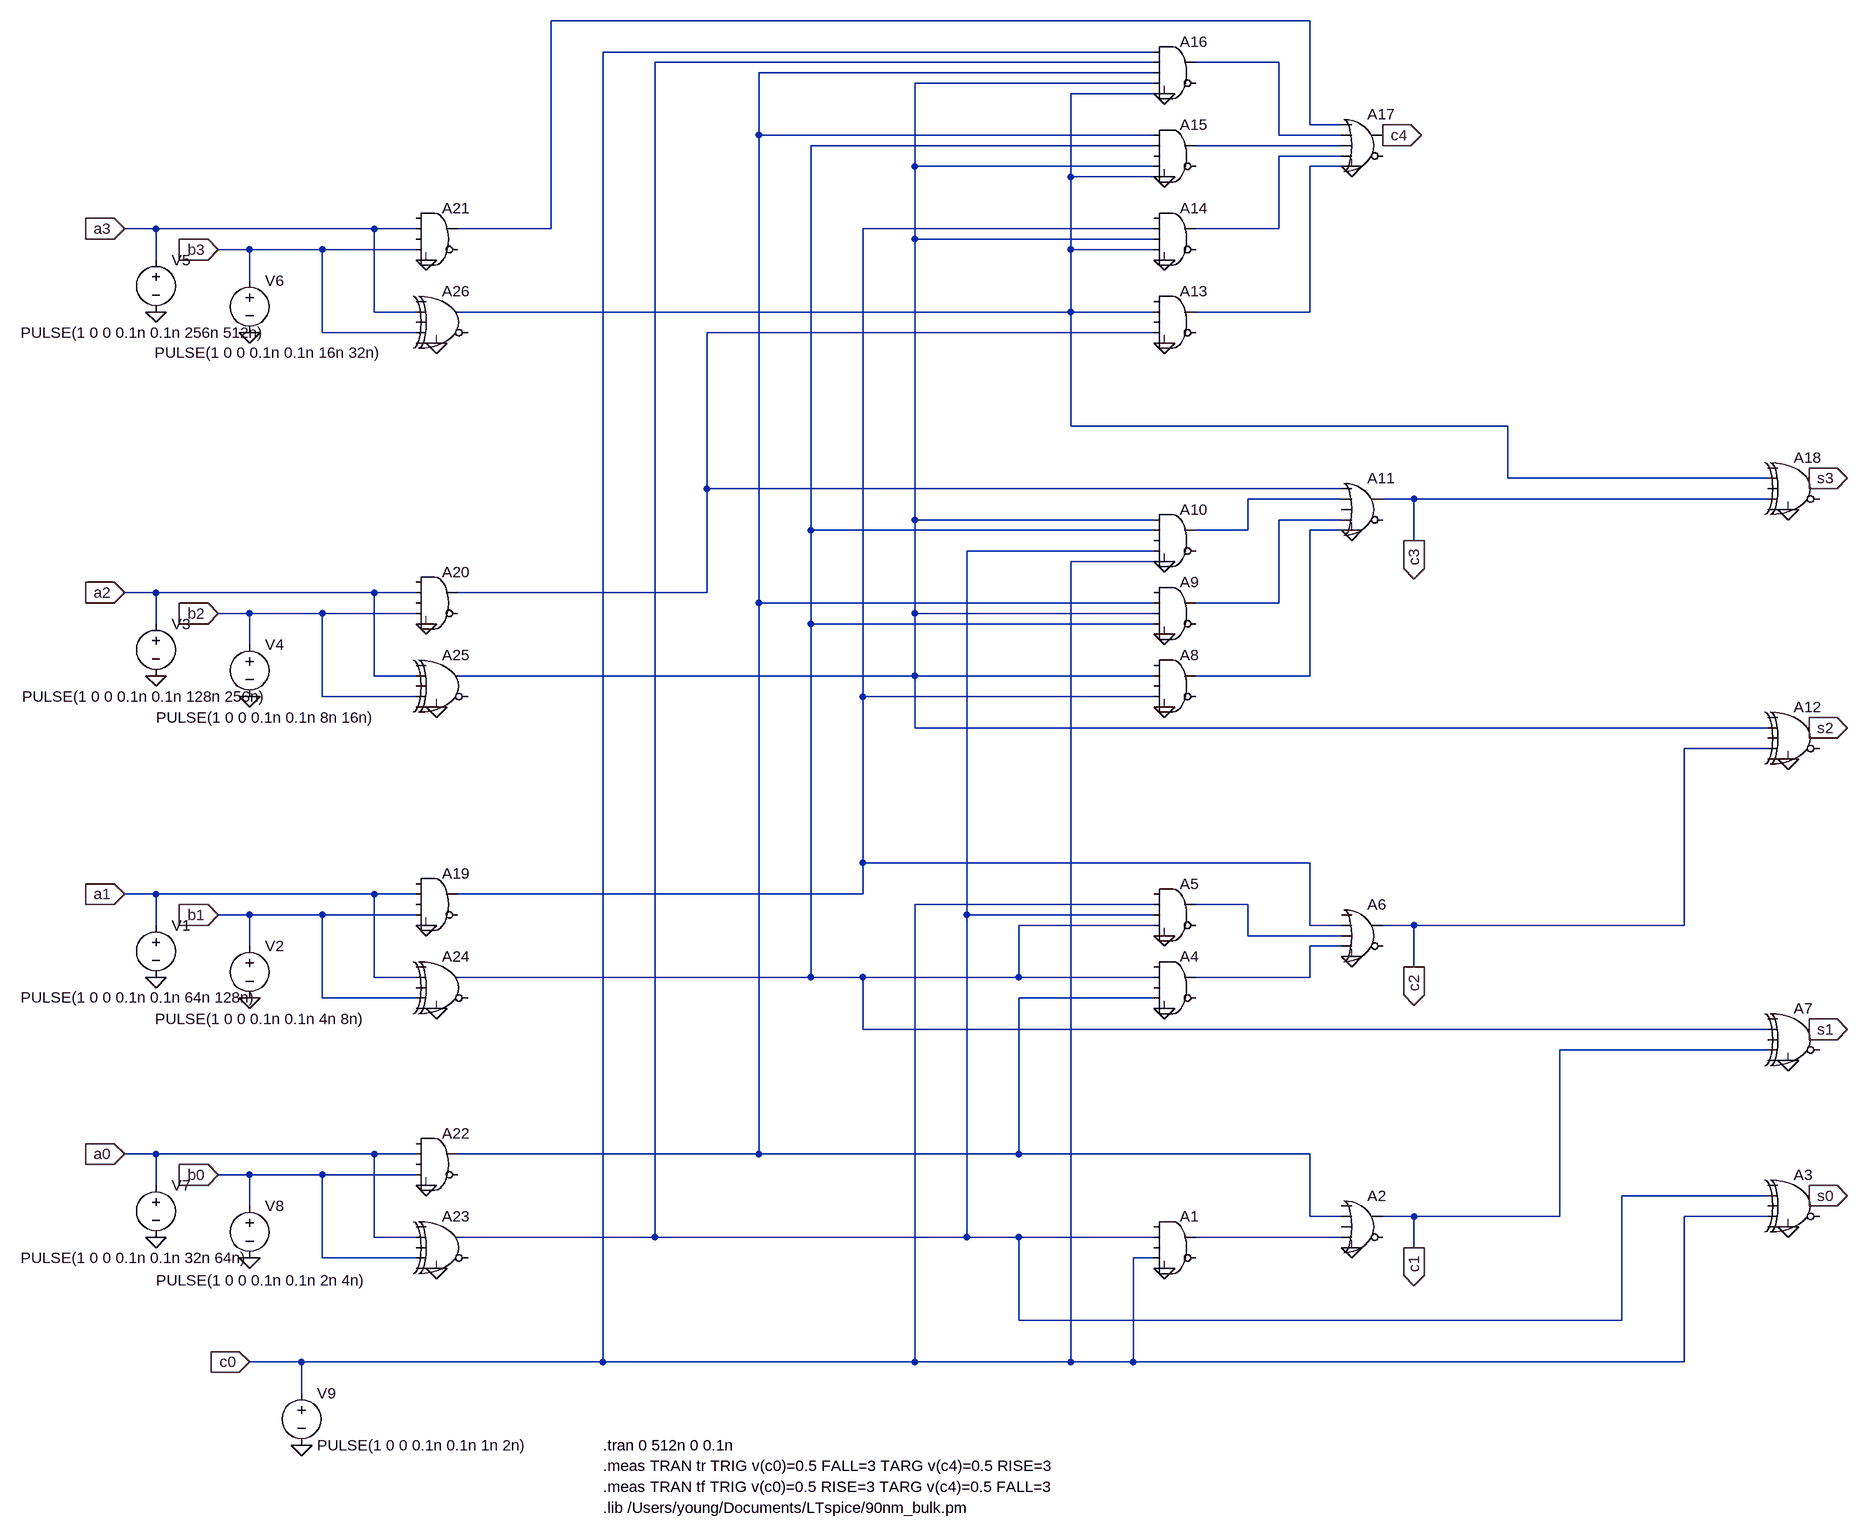
[diagram p0: schematic 4-bit-CLA.asc]
4-bit-CLA.asc, the LTspice schematic file:
Version 4
SHEET 1 2044 1460
WIRE 1216 -992 48 -992
WIRE 976 -944 128 -944
WIRE 976 -928 208 -928
WIRE 1168 -928 1040 -928
WIRE 976 -912 368 -912
WIRE 976 -896 608 -896
WIRE 976 -880 848 -880
WIRE 1216 -832 1216 -992
WIRE 1264 -832 1216 -832
WIRE 368 -816 368 -912
WIRE 976 -816 368 -816
WIRE 1168 -816 1168 -928
WIRE 1264 -816 1168 -816
WIRE 976 -800 448 -800
WIRE 1264 -800 1040 -800
WIRE 1264 -784 1168 -784
WIRE 608 -768 608 -896
WIRE 976 -768 608 -768
WIRE 1264 -768 1216 -768
WIRE 848 -752 848 -880
WIRE 976 -752 848 -752
WIRE -560 -672 -608 -672
WIRE -224 -672 -560 -672
WIRE -160 -672 -224 -672
WIRE 48 -672 48 -992
WIRE 48 -672 -96 -672
WIRE 976 -672 528 -672
WIRE 1168 -672 1168 -784
WIRE 1168 -672 1040 -672
WIRE 608 -656 608 -768
WIRE 976 -656 608 -656
WIRE -416 -640 -464 -640
WIRE -304 -640 -416 -640
WIRE -160 -640 -304 -640
WIRE 848 -640 848 -752
WIRE 976 -640 848 -640
WIRE -560 -624 -560 -672
WIRE -416 -592 -416 -640
WIRE -224 -544 -224 -672
WIRE -160 -544 -224 -544
WIRE 848 -544 848 -640
WIRE 848 -544 -96 -544
WIRE 976 -544 848 -544
WIRE 1216 -544 1216 -768
WIRE 1216 -544 1040 -544
WIRE -304 -512 -304 -640
WIRE -160 -512 -304 -512
WIRE 976 -512 288 -512
WIRE 848 -368 848 -544
WIRE 1520 -368 848 -368
WIRE 1520 -288 1520 -368
WIRE 1920 -288 1520 -288
WIRE 288 -272 288 -512
WIRE 1264 -272 288 -272
WIRE 1264 -256 1120 -256
WIRE 1376 -256 1328 -256
WIRE 1920 -256 1376 -256
WIRE 608 -224 608 -656
WIRE 976 -224 608 -224
WIRE 1264 -224 1168 -224
WIRE 448 -208 448 -800
WIRE 976 -208 448 -208
WIRE 1120 -208 1120 -256
WIRE 1120 -208 1040 -208
WIRE 1264 -208 1216 -208
WIRE 1376 -192 1376 -256
WIRE 976 -176 688 -176
WIRE 976 -160 848 -160
WIRE -560 -112 -608 -112
WIRE -224 -112 -560 -112
WIRE -160 -112 -224 -112
WIRE 288 -112 288 -272
WIRE 288 -112 -96 -112
WIRE 368 -96 368 -816
WIRE 976 -96 368 -96
WIRE 1168 -96 1168 -224
WIRE 1168 -96 1040 -96
WIRE -416 -80 -464 -80
WIRE -304 -80 -416 -80
WIRE -160 -80 -304 -80
WIRE 608 -80 608 -224
WIRE 976 -80 608 -80
WIRE -560 -64 -560 -112
WIRE 448 -64 448 -208
WIRE 976 -64 448 -64
WIRE -416 -32 -416 -80
WIRE -224 16 -224 -112
WIRE -160 16 -224 16
WIRE 608 16 608 -80
WIRE 608 16 -96 16
WIRE 976 16 608 16
WIRE 1216 16 1216 -208
WIRE 1216 16 1040 16
WIRE -304 48 -304 -80
WIRE -160 48 -304 48
WIRE 528 48 528 -672
WIRE 976 48 528 48
WIRE 608 96 608 16
WIRE 1920 96 608 96
WIRE 1920 128 1792 128
WIRE 528 304 528 48
WIRE 1216 304 528 304
WIRE -560 352 -608 352
WIRE -224 352 -560 352
WIRE -160 352 -224 352
WIRE 528 352 528 304
WIRE 528 352 -96 352
WIRE 976 368 608 368
WIRE 1120 368 1040 368
WIRE -416 384 -464 384
WIRE -304 384 -416 384
WIRE -160 384 -304 384
WIRE 688 384 688 -176
WIRE 976 384 688 384
WIRE -560 400 -560 352
WIRE 976 400 768 400
WIRE 1216 400 1216 304
WIRE 1264 400 1216 400
WIRE 1376 400 1328 400
WIRE 1792 400 1792 128
WIRE 1792 400 1376 400
WIRE 1120 416 1120 368
WIRE 1264 416 1120 416
WIRE -416 432 -416 384
WIRE 1264 432 1216 432
WIRE 1376 464 1376 400
WIRE -224 480 -224 352
WIRE -160 480 -224 480
WIRE 448 480 448 -64
WIRE 448 480 -96 480
WIRE 528 480 448 480
WIRE 768 480 768 400
WIRE 768 480 528 480
WIRE 976 480 768 480
WIRE 1216 480 1216 432
WIRE 1216 480 1040 480
WIRE -304 512 -304 384
WIRE -160 512 -304 512
WIRE 976 512 768 512
WIRE 528 560 528 480
WIRE 1920 560 528 560
WIRE 1920 592 1600 592
WIRE -560 752 -608 752
WIRE -224 752 -560 752
WIRE -160 752 -224 752
WIRE 368 752 368 -96
WIRE 368 752 -96 752
WIRE 768 752 768 512
WIRE 768 752 368 752
WIRE 1216 752 768 752
WIRE -416 784 -464 784
WIRE -304 784 -416 784
WIRE -160 784 -304 784
WIRE -560 800 -560 752
WIRE 1920 816 1696 816
WIRE -416 832 -416 784
WIRE 1216 848 1216 752
WIRE 1264 848 1216 848
WIRE 1376 848 1328 848
WIRE 1600 848 1600 592
WIRE 1600 848 1376 848
WIRE 1920 848 1792 848
WIRE -224 880 -224 752
WIRE -160 880 -224 880
WIRE 208 880 208 -928
WIRE 208 880 -96 880
WIRE 688 880 688 384
WIRE 688 880 208 880
WIRE 768 880 688 880
WIRE 976 880 768 880
WIRE 1264 880 1040 880
WIRE 1376 896 1376 848
WIRE -304 912 -304 784
WIRE -160 912 -304 912
WIRE 976 912 944 912
WIRE 768 1008 768 880
WIRE 1696 1008 1696 816
WIRE 1696 1008 768 1008
WIRE -336 1072 -416 1072
WIRE 128 1072 128 -944
WIRE 128 1072 -336 1072
WIRE 608 1072 608 368
WIRE 608 1072 128 1072
WIRE 848 1072 848 -160
WIRE 848 1072 608 1072
WIRE 944 1072 944 912
WIRE 944 1072 848 1072
WIRE 1792 1072 1792 848
WIRE 1792 1072 944 1072
WIRE -336 1120 -336 1072
FLAG -608 352 a1
IOPIN -608 352 In
FLAG -464 384 b1
IOPIN -464 384 In
FLAG -560 480 0
FLAG -416 512 0
FLAG -144 400 0
FLAG -128 528 0
FLAG -144 -64 0
FLAG -128 64 0
FLAG -144 -624 0
FLAG -128 -496 0
FLAG -608 -112 a2
IOPIN -608 -112 In
FLAG -464 -80 b2
IOPIN -464 -80 In
FLAG -560 16 0
FLAG -416 48 0
FLAG -608 -672 a3
IOPIN -608 -672 In
FLAG -464 -640 b3
IOPIN -464 -640 In
FLAG -560 -544 0
FLAG -416 -512 0
FLAG -608 752 a0
IOPIN -608 752 In
FLAG -464 784 b0
IOPIN -464 784 In
FLAG -560 880 0
FLAG -416 912 0
FLAG -144 800 0
FLAG -128 928 0
FLAG -416 1072 c0
IOPIN -416 1072 In
FLAG 1984 816 s0
IOPIN 1984 816 Out
FLAG 1984 560 s1
IOPIN 1984 560 Out
FLAG 1984 96 s2
IOPIN 1984 96 Out
FLAG 1328 -816 c4
IOPIN 1328 -816 Out
FLAG 1984 -288 s3
IOPIN 1984 -288 Out
FLAG -336 1200 0
FLAG 992 -880 0
FLAG 992 -752 0
FLAG 992 -624 0
FLAG 992 -496 0
FLAG 1280 -768 0
FLAG 992 -160 0
FLAG 992 -48 0
FLAG 992 64 0
FLAG 1280 -208 0
FLAG 1952 -240 0
FLAG 1952 144 0
FLAG 1280 448 0
FLAG 992 528 0
FLAG 992 416 0
FLAG 1952 608 0
FLAG 992 928 0
FLAG 1280 896 0
FLAG 1952 864 0
FLAG 1376 896 c1
IOPIN 1376 896 Out
FLAG 1376 464 c2
IOPIN 1376 464 Out
FLAG 1376 -192 c3
IOPIN 1376 -192 Out
SYMBOL voltage -560 384 R0
WINDOW 3 -208 127 Left 2
SYMATTR Value PULSE(1 0 0 0.1n 0.1n 64n 128n)
SYMATTR InstName V1
SYMBOL voltage -416 416 R0
WINDOW 3 -145 128 Left 2
SYMATTR Value PULSE(1 0 0 0.1n 0.1n 4n 8n)
SYMATTR InstName V2
SYMBOL voltage -560 -80 R0
WINDOW 3 -206 128 Left 2
SYMATTR Value PULSE(1 0 0 0.1n 0.1n 128n 256n)
SYMATTR InstName V3
SYMBOL voltage -416 -48 R0
WINDOW 3 -144 128 Left 2
SYMATTR Value PULSE(1 0 0 0.1n 0.1n 8n 16n)
SYMATTR InstName V4
SYMBOL voltage -560 -640 R0
WINDOW 3 -208 128 Left 2
SYMATTR Value PULSE(1 0 0 0.1n 0.1n 256n 512n)
SYMATTR InstName V5
SYMBOL voltage -416 -608 R0
WINDOW 3 -146 127 Left 2
SYMATTR Value PULSE(1 0 0 0.1n 0.1n 16n 32n)
SYMATTR InstName V6
SYMBOL voltage -560 784 R0
WINDOW 3 -208 128 Left 2
SYMATTR Value PULSE(1 0 0 0.1n 0.1n 32n 64n)
SYMATTR InstName V7
SYMBOL voltage -416 816 R0
WINDOW 3 -144 130 Left 2
SYMATTR Value PULSE(1 0 0 0.1n 0.1n 2n 4n)
SYMATTR InstName V8
SYMBOL Digital/and 1008 832 R0
SYMATTR InstName A1
SYMBOL Digital/or 1296 800 R0
SYMATTR InstName A2
SYMBOL Digital/xor 1968 768 R0
SYMATTR InstName A3
SYMBOL Digital/and 1008 432 R0
SYMATTR InstName A4
SYMBOL Digital/and 1008 320 R0
SYMATTR InstName A5
SYMBOL Digital/or 1296 352 R0
SYMATTR InstName A6
SYMBOL Digital/xor 1968 512 R0
SYMATTR InstName A7
SYMBOL Digital/and 1008 -32 R0
SYMATTR InstName A8
SYMBOL Digital/and 1008 -144 R0
SYMATTR InstName A9
SYMBOL Digital/and 1008 -256 R0
SYMATTR InstName A10
SYMBOL Digital/or 1296 -304 R0
SYMATTR InstName A11
SYMBOL Digital/xor 1968 48 R0
SYMATTR InstName A12
SYMBOL Digital/and 1008 -592 R0
SYMATTR InstName A13
SYMBOL Digital/and 1008 -720 R0
SYMATTR InstName A14
SYMBOL Digital/and 1008 -848 R0
SYMATTR InstName A15
SYMBOL Digital/and 1008 -976 R0
SYMATTR InstName A16
SYMBOL Digital/or 1296 -864 R0
SYMATTR InstName A17
SYMBOL Digital/xor 1968 -336 R0
SYMATTR InstName A18
SYMBOL voltage -336 1104 R0
SYMATTR InstName V9
SYMATTR Value PULSE(1 0 0 0.1n 0.1n 1n 2n)
SYMBOL Digital/and -128 304 R0
SYMATTR InstName A19
SYMBOL Digital/and -128 -160 R0
SYMATTR InstName A20
SYMBOL Digital/and -128 -720 R0
SYMATTR InstName A21
SYMBOL Digital/and -128 704 R0
SYMATTR InstName A22
SYMBOL Digital/xor -112 832 R0
SYMATTR InstName A23
SYMBOL Digital/xor -112 432 R0
SYMATTR InstName A24
SYMBOL Digital/xor -112 -32 R0
SYMATTR InstName A25
SYMBOL Digital/xor -112 -592 R0
SYMATTR InstName A26
TEXT 128 1200 Left 2 !.tran 0 512n 0 0.1n
TEXT 128 1232 Left 2 !.meas TRAN tr TRIG v(c0)=0.5 FALL=3 TARG v(c4)=0.5 RISE=3
TEXT 128 1264 Left 2 !.meas TRAN tf TRIG v(c0)=0.5 RISE=3 TARG v(c4)=0.5 FALL=3
TEXT 128 1296 Left 2 !.lib /Users/young/Documents/LTspice/90nm_bulk.pm

The netlist it stands for:
* 4-bit-CLA.asc
V1 a1 0 PULSE(1 0 0 0.1n 0.1n 64n 128n)
V2 b1 0 PULSE(1 0 0 0.1n 0.1n 4n 8n)
V3 a2 0 PULSE(1 0 0 0.1n 0.1n 128n 256n)
V4 b2 0 PULSE(1 0 0 0.1n 0.1n 8n 16n)
V5 a3 0 PULSE(1 0 0 0.1n 0.1n 256n 512n)
V6 b3 0 PULSE(1 0 0 0.1n 0.1n 16n 32n)
V7 a0 0 PULSE(1 0 0 0.1n 0.1n 32n 64n)
V8 b0 0 PULSE(1 0 0 0.1n 0.1n 2n 4n)
A1 0 N002 0 c0 0 0 N018 0 AND
A2 0 N004 0 N018 0 0 c1 0 OR
A3 0 N002 0 c0 0 0 s0 0 XOR
A4 0 N007 0 N004 0 0 N017 0 AND
A5 0 c0 N002 N007 0 0 N016 0 AND
A6 0 N011 N016 N017 0 0 c2 0 OR
A7 0 N007 0 c1 0 0 s1 0 XOR
A8 0 N005 0 N011 0 0 N015 0 AND
A9 0 N004 N005 N007 0 0 N014 0 AND
A10 N005 N007 0 N002 c0 0 N013 0 AND
A11 N012 N013 0 N014 N015 0 c3 0 OR
A12 0 N005 0 c2 0 0 s2 0 XOR
A13 0 N006 0 N012 0 0 N010 0 AND
A14 0 N011 N005 N006 0 0 N009 0 AND
A15 N004 N007 0 N005 N006 0 N008 0 AND
A16 c0 N002 N004 N005 N006 0 N003 0 AND
A17 N001 N003 N008 N009 N010 0 c4 0 OR
A18 0 N006 0 c3 0 0 s3 0 XOR
V9 c0 0 PULSE(1 0 0 0.1n 0.1n 1n 2n)
A19 0 a1 0 b1 0 0 N011 0 AND
A20 0 a2 0 b2 0 0 N012 0 AND
A21 0 a3 0 b3 0 0 N001 0 AND
A22 0 a0 0 b0 0 0 N004 0 AND
A23 0 a0 0 b0 0 0 N002 0 XOR
A24 0 a1 0 b1 0 0 N007 0 XOR
A25 0 a2 0 b2 0 0 N005 0 XOR
A26 0 a3 0 b3 0 0 N006 0 XOR
.tran 0 512n 0 0.1n
.meas TRAN tr TRIG v(c0)=0.5 FALL=3 TARG v(c4)=0.5 RISE=3
.meas TRAN tf TRIG v(c0)=0.5 RISE=3 TARG v(c4)=0.5 FALL=3
.lib /Users/young/Documents/LTspice/90nm_bulk.pm
.backanno
.end

* Results of the author's LTspice run, read from the files saved beside the schematic
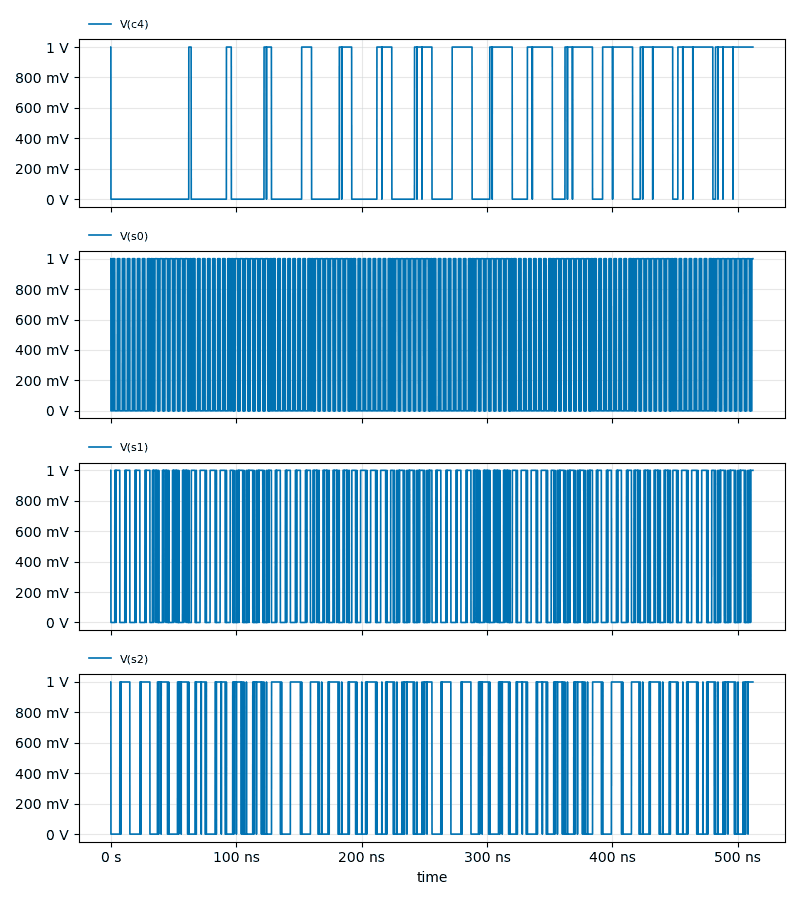
[diagram p1: Transient Analysis of 4-bit-CLA.asc, plotted from the saved traces]
* Transient Analysis, 1 run:
*   V(c4): min 0 V, max 1 V, average 462.6 mV, rms 680.1 mV, last 1 V
*   V(s0): min 0 V, max 1 V, average 498.5 mV, rms 706 mV, last 1 V
*   V(s1): min 0 V, max 1 V, average 499.2 mV, rms 706.6 mV, last 1 V
*   V(s2): min 0 V, max 1 V, average 499.6 mV, rms 706.8 mV, last 1 V
* From the log:
*   tr=1.18094e-07 FROM 4.05e-09 TO 1.22144e-07
*   tf=9.0895e-08 FROM 5.15e-09 TO 9.6045e-08